# Altium schematic sheet Sheet1.SchDoc
size A1; SheetNumber: 1; SheetTotal: 1
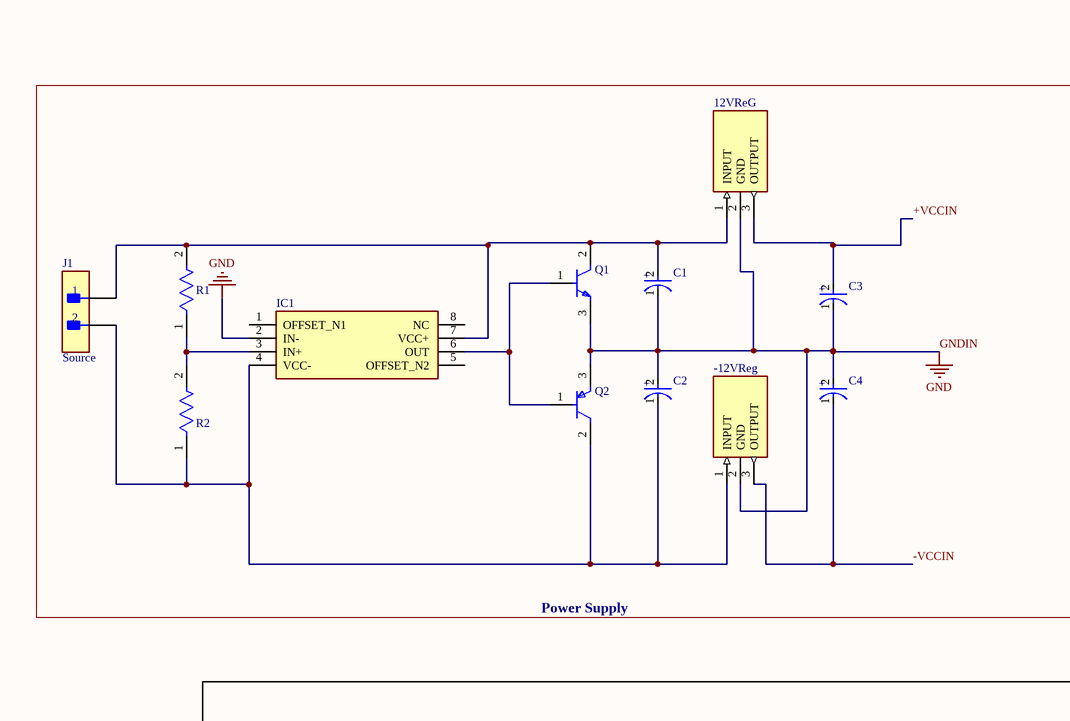
[diagram p0: Sheet1.SchDoc, top left]
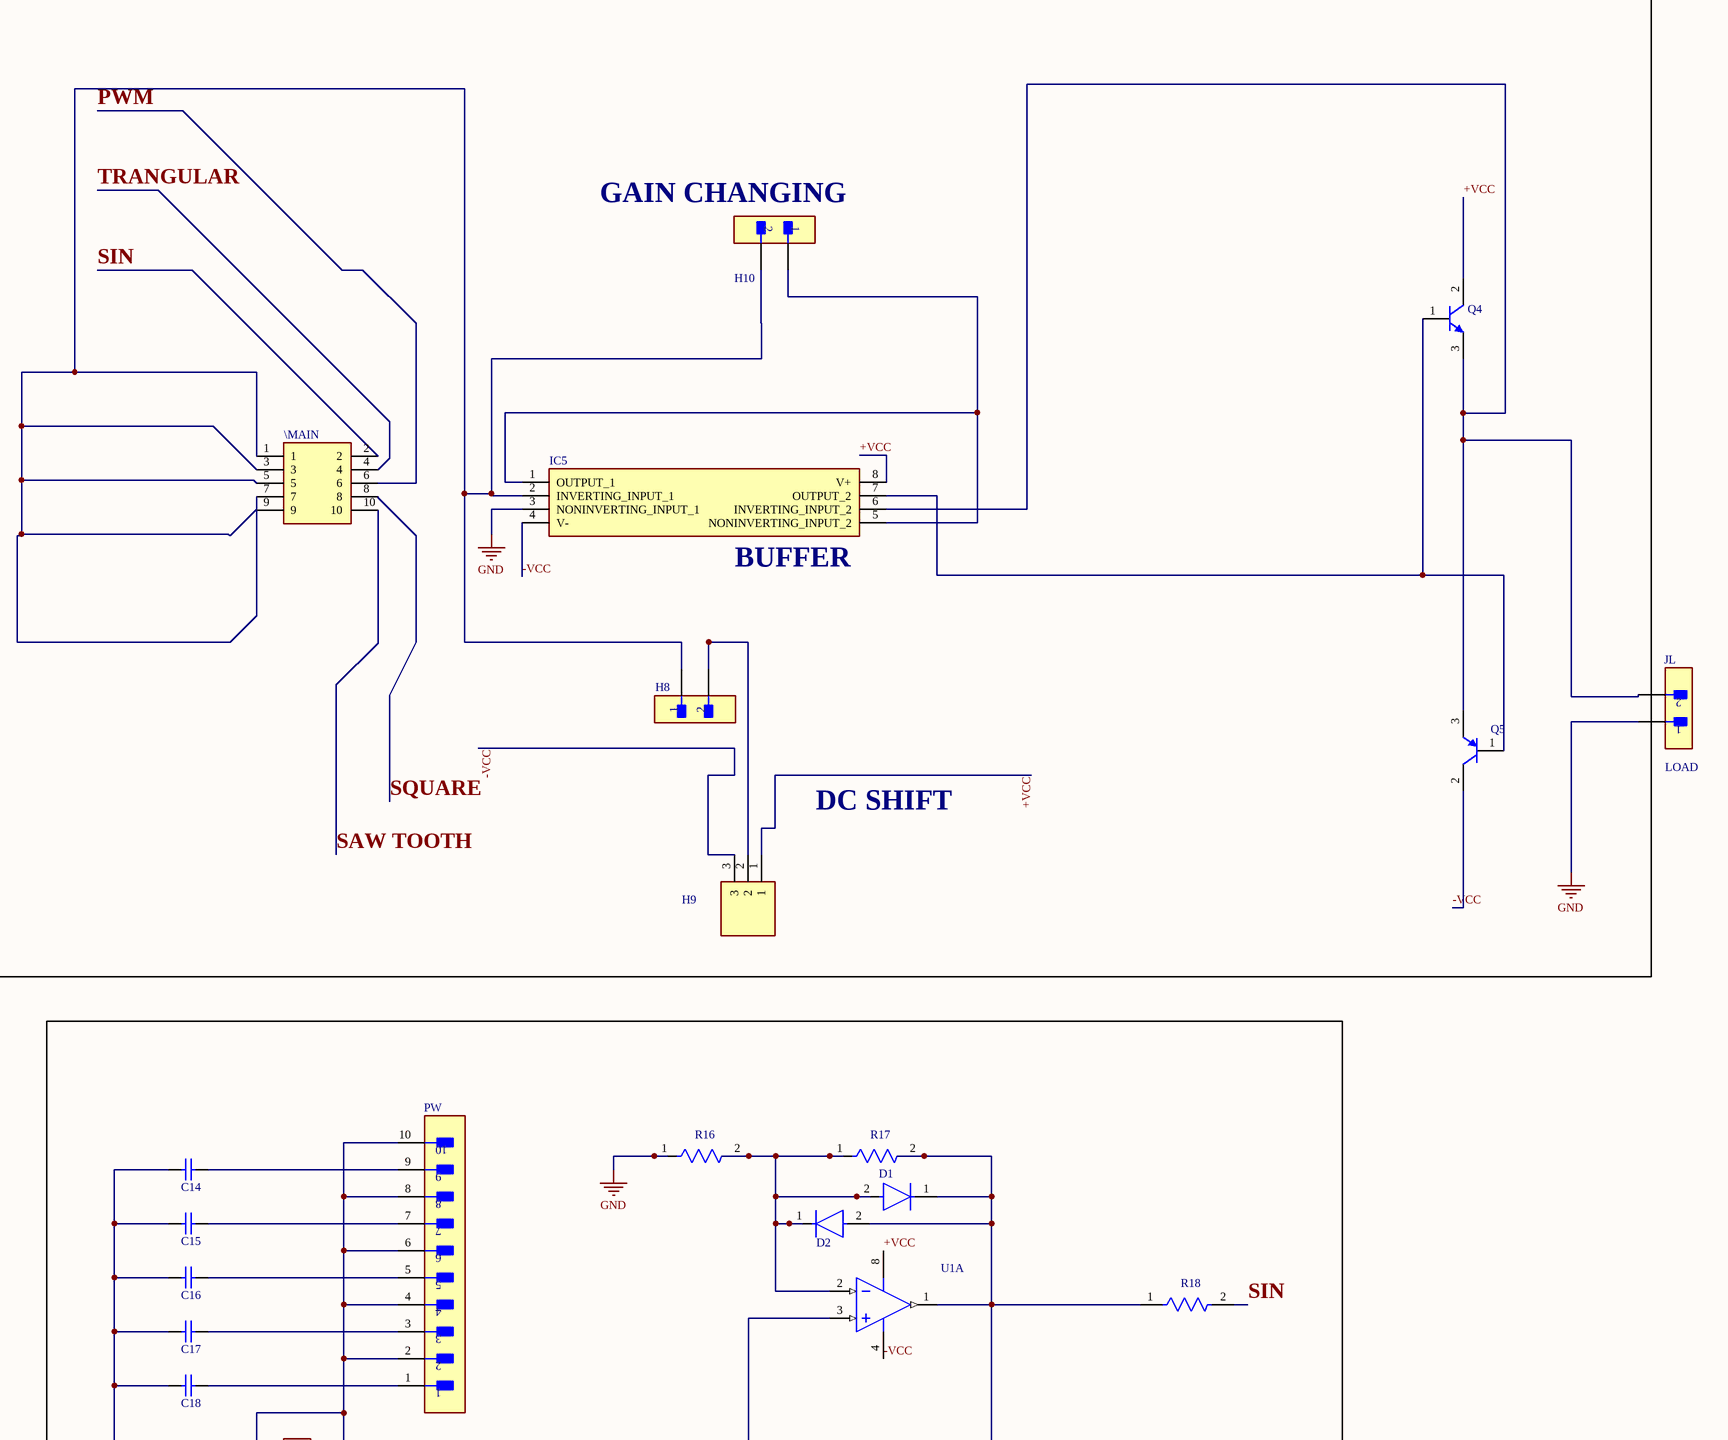
[diagram p1: Sheet1.SchDoc, top right]
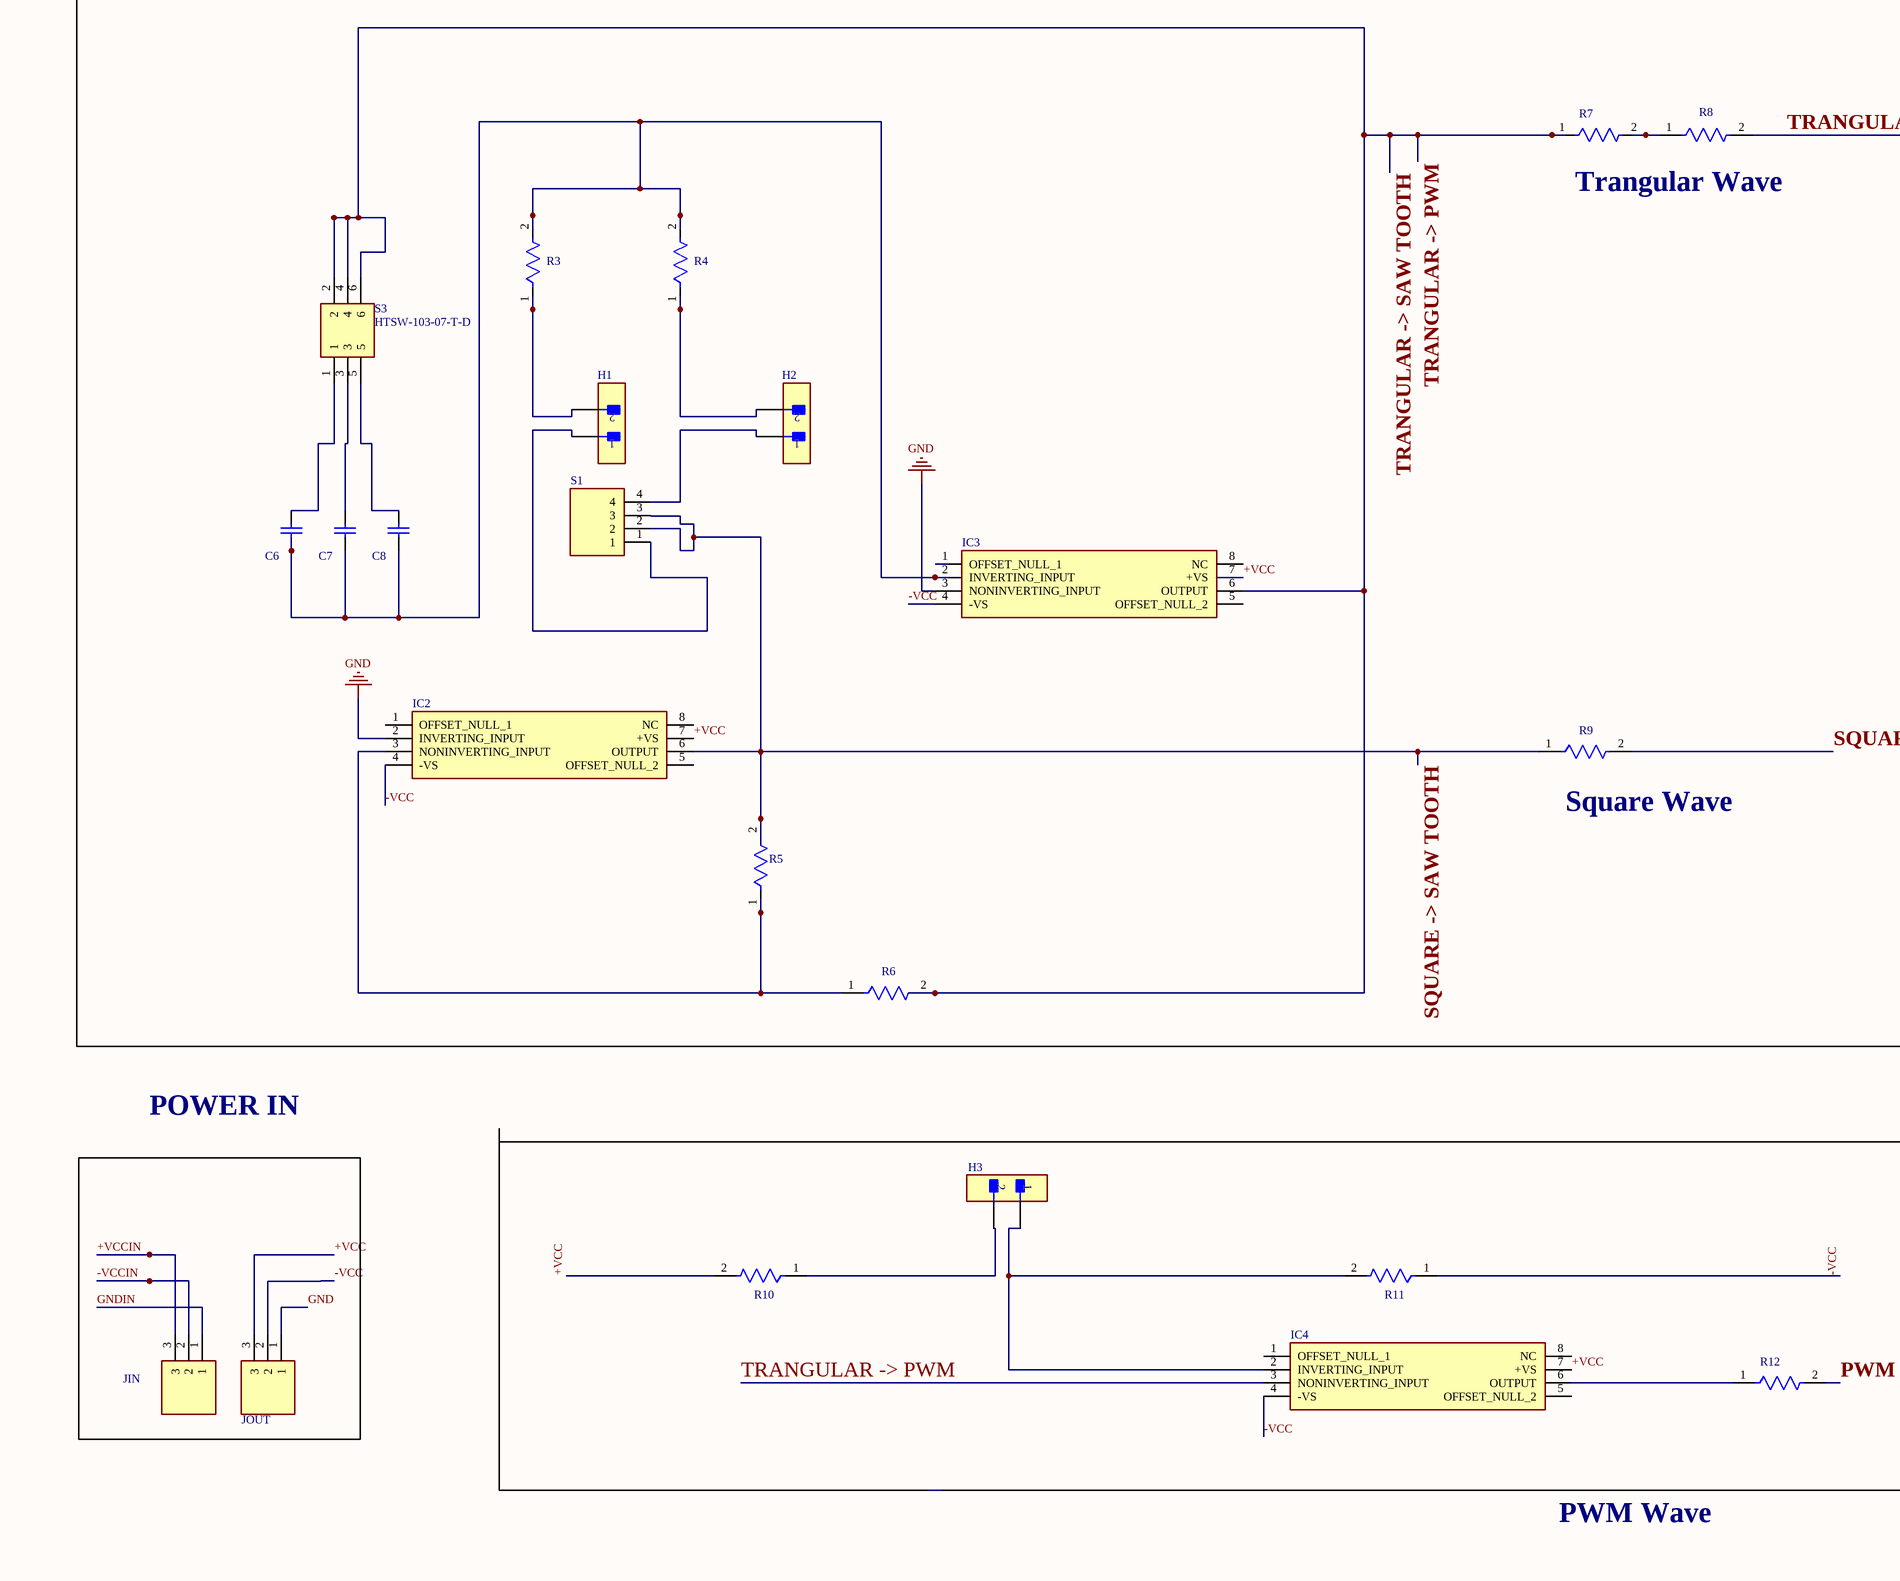
[diagram p2: Sheet1.SchDoc, bottom left]
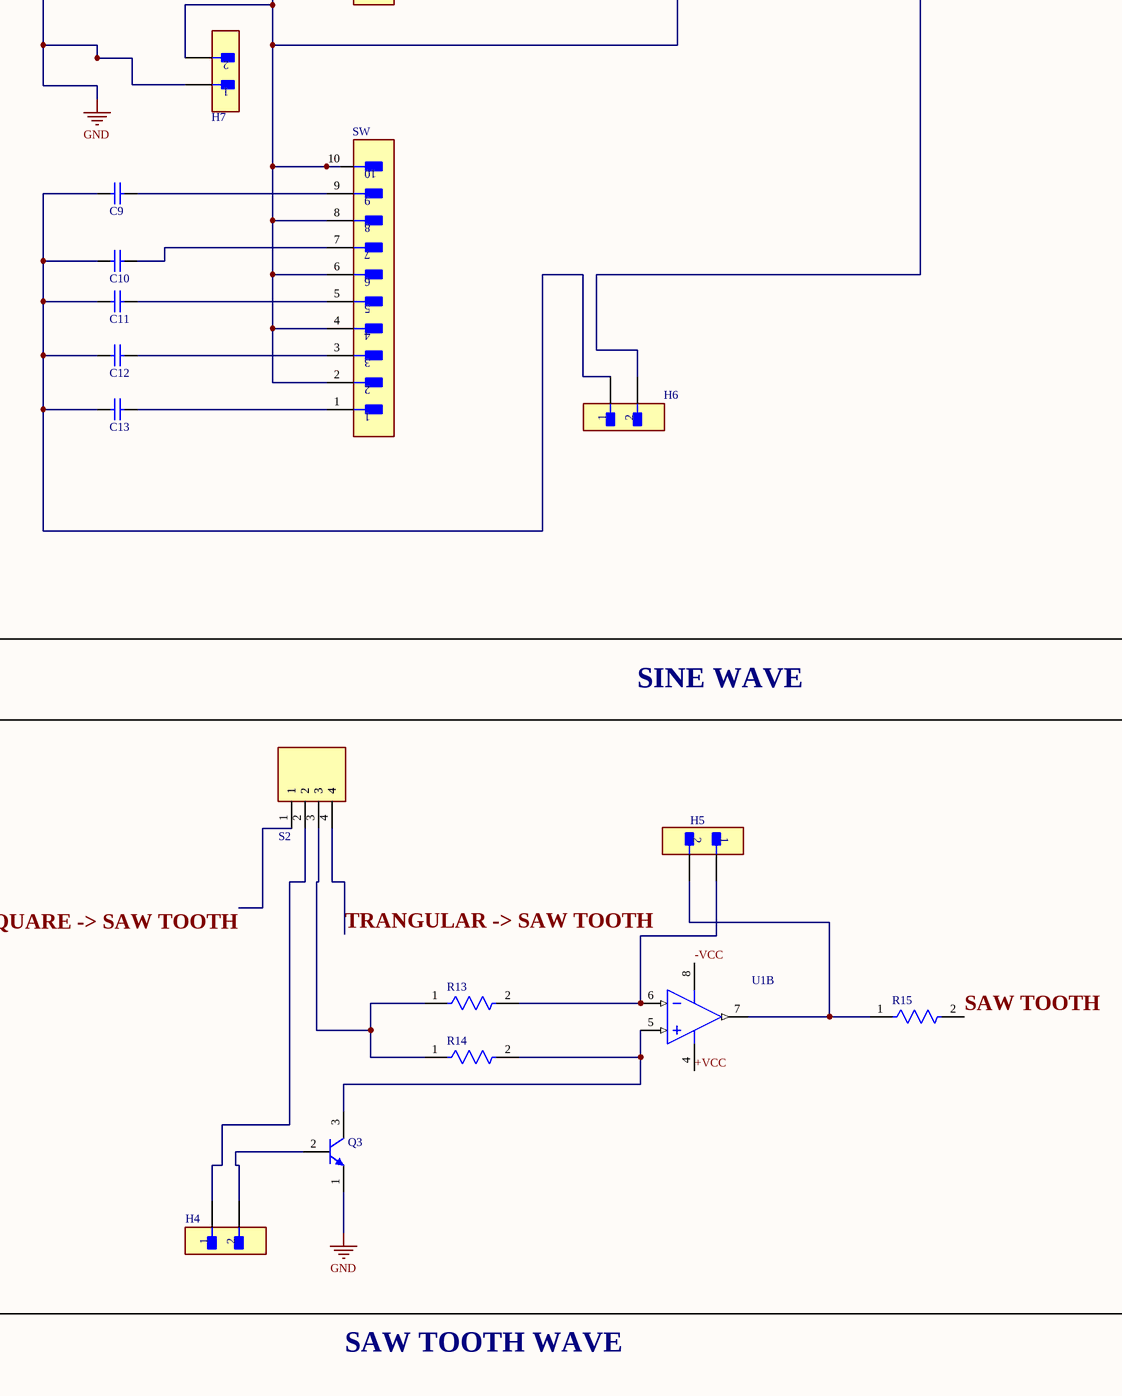
[diagram p3: Sheet1.SchDoc, bottom right]

## Parts
12VReG  LM7812CT  [TO254P470X1028X1955-3P]  (value not drawn)
-12VReg  LM7812CT  [TO254P470X1028X1955-3P]  (value not drawn)
\MAIN  61201021621  [SHDR10W64P254_2X5_2036X885X925P]  (value not drawn)
C1  EEUFR1E391L  [FP-RAD-TH-D_8_0_5-L_15_1-MFG]  (value not drawn)
C2  EEUFR1E391L  [FP-RAD-TH-D_8_0_5-L_15_1-MFG]  (value not drawn)
C3  EEUFR1E391L  [FP-RAD-TH-D_8_0_5-L_15_1-MFG]  (value not drawn)
C4  EEUFR1E391L  [FP-RAD-TH-D_8_0_5-L_15_1-MFG]  (value not drawn)
C6  1uF  [KEMT-C333C105M5U5TA-2]  (value not drawn)
C7  0.1uF  [KEMT-C333C105M5U5TA-2]  (value not drawn)
C8  0.01uF  [KEMT-C333C105M5U5TA-2]  (value not drawn)
C9  10uF  [KEMT-C333C105M5U5TA-2]  (value not drawn)
C10  1uF  [KEMT-C333C105M5U5TA-2]  (value not drawn)
C11  100nF  [KEMT-C333C105M5U5TA-2]  (value not drawn)
C12  10nF  [KEMT-C333C105M5U5TA-2]  (value not drawn)
C13  1nF  [KEMT-C333C105M5U5TA-2]  (value not drawn)
C14  10uF  [KEMT-C333C105M5U5TA-2]  (value not drawn)
C15  1uF  [KEMT-C333C105M5U5TA-2]  (value not drawn)
C16  100nF  [KEMT-C333C105M5U5TA-2]  (value not drawn)
C17  10nF  [KEMT-C333C105M5U5TA-2]  (value not drawn)
C18  1nF  [KEMT-C333C105M5U5TA-2]  (value not drawn)
D1  1N4148  [FP-017AG-MFG]  (value not drawn)
D2  1N4148  [FP-017AG-MFG]  (value not drawn)
H1  LOAD  [FP-B2B-XH-A_LF_SN-MFG]  (value not drawn)
H2  LOAD  [FP-B2B-XH-A_LF_SN-MFG]  (value not drawn)
H3  LOAD  [FP-B2B-XH-A_LF_SN-MFG]  (value not drawn)
H4  LOAD  [FP-B2B-XH-A_LF_SN-MFG]  (value not drawn)
H5  LOAD  [FP-B2B-XH-A_LF_SN-MFG]  (value not drawn)
H6  LOAD  [FP-B2B-XH-A_LF_SN-MFG]  (value not drawn)
H7  LOAD  [FP-B2B-XH-A_LF_SN-MFG]  (value not drawn)
H8  LOAD  [FP-B2B-XH-A_LF_SN-MFG]  (value not drawn)
H9  0022232031  [HDRV3W87P0X254_1X3_747X635X1105P]  (value not drawn)
H10  LOAD  [FP-B2B-XH-A_LF_SN-MFG]  (value not drawn)
IC1  TL071CP  [DIP794W53P254L959H508Q8N]  (value not drawn)
IC2  AD711JN  [DIP794W56P254L928H457Q8N]  (value not drawn)
IC3  AD711JN  [DIP794W56P254L928H457Q8N]  (value not drawn)
IC4  AD711JN  [DIP794W56P254L928H457Q8N]  (value not drawn)
IC5  AD712JNZ  [DIP794W56P254L959H533Q8N]  (value not drawn)
J1  Source  [FP-B2B-XH-A_LF_SN-MFG]
JIN  0022232031  [HDRV3W87P0X254_1X3_747X635X1105P]  (value not drawn)
JL  LOAD  [FP-B2B-XH-A_LF_SN-MFG]
JOUT  0022232031  [HDRV3W87P0X254_1X3_747X635X1105P]  (value not drawn)
PW  in 1  [FP-4-644456-0-MFG]  (value not drawn)
Q1  TIP31C  [FP-TO-220-P0A0015988-MFG]  (value not drawn)
Q2  TIP32C  [FP-TO-220-P0A0015988-MFG]  (value not drawn)
Q3  SAWTOOTH  [FAIR-TO-92]  (value not drawn)
Q4  TIP31A  [ONSC-TO-220-3-221A-09]  (value not drawn)
Q5  TIP32A  [ONSC-TO-220-3-221A-09]  (value not drawn)
R1  100K  [FP-RR01-MFG]  (value not drawn)
R2  100K  [FP-RR01-MFG]  (value not drawn)
R3  150ohm  [FP-RLR07-MFG]  (value not drawn)
R4  10K  [FP-RLR07-MFG]  (value not drawn)
R5  1K  [FP-MBB0207-MFG]  (value not drawn)
R6  150OHM  [FP-MBB0207-MFG]  (value not drawn)
R7  6.8K  [FP-MBB0207-MFG]  (value not drawn)
R8  10K  [FP-MBB0207-MFG]  (value not drawn)
R9  10K  [FP-MBB0207-MFG]  (value not drawn)
R10  10K  [FP-MBB0207-MFG]  (value not drawn)
R11  10K  [FP-MBB0207-MFG]  (value not drawn)
R12  68Kohm  [FP-MBB0207-MFG]  (value not drawn)
R13  10K  [FP-MBB0207-MFG]  (value not drawn)
R14  10K  [FP-MBB0207-MFG]  (value not drawn)
R15  10k  [FP-MBB0207-MFG]  (value not drawn)
R16  5K  [FP-MBB0207-MFG]  (value not drawn)
R17  10K  [FP-MBB0207-MFG]  (value not drawn)
R18  0.5K  [FP-MBB0207-MFG]  (value not drawn)
S1  B4B-XH-A_LF__SN_  [B4BXHALFSN]  (value not drawn)
S2  B4B-XH-A_LF__SN_  [B4BXHALFSN]  (value not drawn)
S3  HTSW-103-07-T-D  [HDRV6W64P254_2X3_762X502X838P]
SW  in2  [FP-4-644456-0-MFG]  (value not drawn)
U1  TL072CP  [P0008A]  (value not drawn)  (parts A,B of 2)

## Blocks framed on the sheet
Power Supply: 12VReG -12VReg C1-C4 IC1 J1 Q1 Q2 R1 R2

## Nets
GND: 12VReG.2(GND) -12VReg.2(GND) C1.1(C) C2.2(A) C3.1(C) C4.2(A) C14.2 C15.2 C16.2 C17.2 C18.2 H7.1 IC1.2(IN-) IC2.2(INVERTING_INPUT) IC3.3(NONINVERTING_INPUT) IC5.3(NONINVERTING_INPUT_1) JIN.1 JL.1 JOUT.1 Q1.3(E) Q2.3(E) Q3.1(E) R16.1  [also labelled GNDIN]
+VCC: H9.1 IC2.7(+VS) IC3.7(+VS) IC4.7(+VS) IC5.8(V+) JOUT.3 Q4.2(C) R10.2 U1.4(VCC-) U1.8(VCC+)
+VCCIN: 12VReG.3(OUTPUT) C3.2(A) JIN.3
-VCC: H9.3 IC2.4(-VS) IC3.4(-VS) IC4.4(-VS) IC5.4(V-) JOUT.2 Q5.2(C) R11.1 U1.4(VCC-) U1.8(VCC+)
-VCCIN: -12VReg.3(OUTPUT) C4.1(C) JIN.2
PWM: \MAIN.6 R12.2
SAW TOOTH: \MAIN.10 R15.2
SIN: \MAIN.2 R18.2
SQUARE: \MAIN.8 R9.2
SQUARE -> SAW TOOTH: IC2.6(OUTPUT) R5.2 R9.1 S1.2 S1.3 S2.1
TRANGULAR: \MAIN.4 R8.2
TRANGULAR -> PWM: IC3.6(OUTPUT) IC4.3(NONINVERTING_INPUT) R6.2 R7.1 S2.4 S3.2 S3.4 S3.6  [also labelled TRANGULAR -> SAW TOOTH]
Net12VReG_1: 12VReG.1(INPUT) C1.2(A) IC1.7(VCC+) J1.1 Q1.2(C) R1.2
Net-12VReg_1: -12VReg.1(INPUT) C2.1(C) IC1.4(VCC-) J1.2 Q2.2(C) R2.1
Ne~{t}MAIN_1: \MAIN.1 \MAIN.3 \MAIN.5 \MAIN.7 \MAIN.9 H8.1 H10.2 IC5.2(INVERTING_INPUT_1)
NetC6_1: C6.1 C7.1 C8.1 IC3.2(INVERTING_INPUT) R3.2 R4.2
NetC6_2: C6.2 S3.1
NetC7_2: C7.2 S3.3
NetC8_2: C8.2 S3.5
NetC9_1: C9.1 SW.9
NetC9_2: C9.2 C10.2 C11.2 C12.2 C13.2 H6.1
NetC10_1: C10.1 SW.7
NetC11_1: C11.1 SW.5
NetC12_1: C12.1 SW.3
NetC13_1: C13.1 SW.1
NetC14_1: C14.1 PW.9
NetC15_1: C15.1 PW.7
NetC16_1: C16.1 PW.5
NetC17_1: C17.1 PW.3
NetC18_1: C18.1 PW.1
NetD1_1: D1.1(C) D2.2(A) H6.2 R17.2 R18.1 U1.1(OUT1)
NetD1_2: D1.2(A) D2.1(C) R16.2 R17.1 U1.2(IN1-)
NetH1_1: H1.1 S1.1
NetH1_2: H1.2 R3.1
NetH2_1: H2.1 S1.4
NetH2_2: H2.2 R4.1
NetH3_1: H3.1 IC4.2(INVERTING_INPUT) R11.2
NetH3_2: H3.2 R10.1
NetH4_1: H4.1 S2.2
NetH4_2: H4.2 Q3.2(B)
NetH5_1: H5.1 R13.2 U1.6(IN2-)
NetH5_2: H5.2 R15.1 U1.7(OUT2)
NetH7_2: H7.2 PW.2 PW.4 PW.6 PW.8 PW.10 SW.2 SW.4 SW.6 SW.8 SW.10 U1.3(IN1+)
NetH8_2: H8.2 H9.2
NetH10_1: H10.1 IC5.1(OUTPUT_1) IC5.5(NONINVERTING_INPUT_2)
NetIC1_3: IC1.3(IN+) R1.1 R2.2
NetIC1_6: IC1.6(OUT) Q1.1(B) Q2.1(B)
NetIC2_3: IC2.3(NONINVERTING_INPUT) R5.1 R6.1
NetIC4_6: IC4.6(OUTPUT) R12.1
NetIC5_6: IC5.6(INVERTING_INPUT_2) JL.2 Q4.3(E) Q5.3(E)
NetIC5_7: IC5.7(OUTPUT_2) Q4.1(B) Q5.1(B)
NetQ3_3: Q3.3(C) R14.2 U1.5(IN2+)
NetR7_2: R7.2 R8.1
NetR13_1: R13.1 R14.1 S2.3

Not connected (* = marked no-connect by the designer): IC1 1(OFFSET_N1) 5(OFFSET_N2) 8(NC); IC2 1(OFFSET_NULL_1) 5(OFFSET_NULL_2) 8(NC); IC3 1(OFFSET_NULL_1) 5(OFFSET_NULL_2) 8(NC); IC4 1(OFFSET_NULL_1) 5(OFFSET_NULL_2) 8(NC)

## Notes on the sheet
- (near H10) GAIN CHANGING
- (near IC5) BUFFER
- DC SHIFT
- Trangular Wave
- (near R9) Square Wave
- SINE WAVE
- POWER IN
- PWM Wave
- SAW TOOTH WAVE
- (in symbol CMP-05427-000460-1) +

## Library data of the parts
12VReG -12VReg = LM7812CT: Integrated Circuit; Manufacturer_Name: Texas Instruments; Datasheet Link: http://www.ti.com/lit/ds/symlink/lm7800.pdf; Height: 4.7mm; Manufacturer_Part_Number: LM7812CT; Mouser Part Number: 926-LM7812CT; Mouser Price/Stock: https://www.mouser.co.uk/ProductDetail/Texas-Instruments/LM7812CT?qs=QbsRYf82W3EQj7KGft8TFg%3D%3D
\MAIN = 61201021621: Connector; Manufacturer_Name: Wurth Elektronik; Datasheet Link: https://datasheet.datasheetarchive.com/originals/distributors/Datasheets_SAMA/ec2d1eaddfe1dc3d07279947380a13e2.pdf; Height: 9.25mm; Manufacturer_Part_Number: 61201021621; Mouser Part Number: 710-61201021621; Mouser Price/Stock: https://www.mouser.co.uk/ProductDetail/Wurth-Elektronik/61201021621?qs=W%252B2sBeLta1a0dwX5pxbfXw%3D%3D
C1-C4 = CMP-05427-000460-1: Aluminum Electrolytic Capacitors (Radial Lead Type) 390uF ±20% 25V; Impedance: 41mR; Lead Diameter: 0.6mm; Ripple Current (AC): 1.24A; Life (Hours): 8000Hour; Dielectric Material: Aluminium; Length: 15mm; Case/Package: Radial; Termination: Radial; Tolerance: 20%; Series: FR; RoHS Compliant: Yes; Height: 15mm; Package Quantity: 200; Construction: RADIAL; Diameter: 8mm; Mount: Through Hole; REACH SVHC: No SVHC; Voltage Rating: 25V; Packaging: Bulk; ESR (Equivalent Series Resistance): 41mR; Min Operating Temperature: -40°C; Ripple Current: 1.24A; Max Operating Temperature: 105°C; Lead Pitch: 3.5mm; Radiation Hardening: No; Capacitance: 390uF; Voltage: 25V; Number of Pins: 2; Height - Seated (Max): 0.65inch; Voltage Rating (DC): 25V
C6 C10 C15 = CMP-2000-05174-1: Multilayer Ceramic Capacitor / Axial and Radial Leaded, 1 uF, +/- 20%, 10 to 85 degC, 2-Pin THD, RoHS, Bulk; Manufacturer: Kemet; Voltage Rating: 50V; Temperature Coefficient / Code: Z5U; Case Height: 3.81mm; Lead Diameter: 0.51mm; Case Style: ConformallyCoated; Dissipation Factor DF: 4; Case Length: 9.91mm; Type: RadialLeads; Case Width: 7.62mm; Dimensions: 7.62mmWx9.91mmLx3.81mmH; Termination Style: Radial; Factory Pack Quantity: 250; Packaging: Bulk; RoHS: Details; Datasheet Version: Jul-09; Lead Spacing: 5.08mm; Product Category: MultilayerCeramicCapacitorsMLCC-Leaded; Maximum Operating Temperature: +125C; Product: GeneralTypeMLCCs; Manufacturer URL: http://www.kemet.com/; Capacitance: 1uF; Lead Style: InsideBend; Operating Temperature Range: -55Cto+125C; Datasheet URL: http://www.farnell.com/datasheets/706880.pdf; Voltage Rating DC: 50V; Brand: Kemet; Series: C333; Tolerance: 20%; Minimum Operating Temperature: -55C
C7-C9 C11-C14 C16-C18 = CMP-2000-05174-1: Multilayer Ceramic Capacitor / Axial and Radial Leaded, 1 uF, +/- 20%, 10 to 85 degC, 2-Pin THD, RoHS, Bulk; Manufacturer: Kemet; Voltage Rating: 50V; Temperature Coefficient / Code: Z5U; Case Height: 3.81mm; Lead Diameter: 0.51mm; Case Style: ConformallyCoated; Dissipation Factor DF: 4; Capacitance: 1uF; Case Length: 9.91mm; Type: RadialLeads; Case Width: 7.62mm; Dimensions: 7.62mmWx9.91mmLx3.81mmH; Termination Style: Radial; Factory Pack Quantity: 250; Packaging: Bulk; RoHS: Details; Datasheet Version: Jul-09; Lead Spacing: 5.08mm; Product Category: MultilayerCeramicCapacitorsMLCC-Leaded; Maximum Operating Temperature: +125C; Product: GeneralTypeMLCCs; Manufacturer URL: http://www.kemet.com/; Lead Style: InsideBend; Operating Temperature Range: -55Cto+125C; Datasheet URL: http://www.farnell.com/datasheets/706880.pdf; Voltage Rating DC: 50V; Brand: Kemet; Series: C333; Tolerance: 20%; Minimum Operating Temperature: -55C
D1 D2 = CMP-07163-000046-1: DIODE GEN PURP 100V 200MA DO35; Forward Voltage: 1V; Max Power Dissipation: 500mW; Max Reverse Current: 5uA; Forward Current: 300mA; Current: 4A; Reverse Recovery Time: 4ns; Element Configuration: Single; Outside Diameter: 1.85mm; Capacitance: 4pF; Polarity: Standard; Max Forward Surge Current (Ifsm): 1A; Reverse Voltage: 100V; Output Current: 200mA; Average Rectified Current: 200mA; Diameter: 1.91mm; Max Repetitive Reverse Voltage (Vrrm): 100V; Current Rating: 200mA; Case/Package: DO-35; Lead Free: Lead Free; Number of Pins: 2; Recovery Time: 4ns; Packaging: Bulk; Contact Plating: Tin; Voltage: 100V; Mount: Through Hole; Max Surge Current: 4A; Package Quantity: 2000; Width: 1.91mm; Max Reverse Voltage (DC): 100V; Length: 4.56mm; Radiation Hardening: No; Power Dissipation: 500mW; Voltage Rating (DC): 100V; Peak Non-Repetitive Surge Current: 4A; REACH SVHC: No SVHC; Height: 4.56mm; Max Operating Temperature: 175°C; Series: -; Weight: 0.01lb; Min Operating Temperature: -65°C
H1-H8 H10 J1 JL = CMP-2000-05888-3: CONN HEADER VERT 2POS 2.5MM; Current Rating: 3A; Voltage Rating: 250V; Number of Contacts: 2; Contact Resistance: 20mR; Wire/Cable Gauge: 22AWG; Insulation Resistance: 1GR; Connector Type: Male Pin; Packaging: Bulk; Contact Material: Brass; Lead Free: Lead Free; Orientation: Straight; Contact Plating: Tin; Max Current Rating: 3A; Termination: Solder; Fastening Type: Detent; Depth: 5.75mm; Housing Material: Polyamide; REACH SVHC: No SVHC; Series: XH; Voltage Rating (AC): 250V; Number of Positions: 2; Color: Natural; Contact Type: Male Pin; Max Voltage Rating (DC): 250V; Pitch: 2.5mm; Lead Pitch: 2.5mm; Mount: Through Hole; Max Operating Temperature: 85°C; Length: 7.4mm; Max Voltage Rating (AC): 250V; Min Operating Temperature: -25°C; Number of Rows: 1; Housing Color: White
H9 JIN JOUT = 0022232031: Connector; Manufacturer_Name: Molex; Datasheet Link: https://www.molex.com/pdm_docs/sd/022232031_sd.pdf; Height: 11.05mm; Manufacturer_Part_Number: 0022232031; Mouser Part Number: N/A; Mouser Price/Stock: https://www.mouser.co.uk/ProductDetail/Molex/0022232031?qs=PBcRNPEHKsqLjUBIVcYwpw%3D%3D; Arrow Part Number: 0022232031; Arrow Price/Stock: https://www.arrow.com/en/products/0022232031/molex?region=europe
IC1 = TL071CP: Integrated Circuit; Manufacturer_Name: Texas Instruments; Datasheet Link: http://www.ti.com/lit/ds/symlink/tl071a.pdf; Height: 5.08mm; Manufacturer_Part_Number: TL071CP; Mouser Part Number: 595-TL071CP; Mouser Price/Stock: https://www.mouser.co.uk/ProductDetail/Texas-Instruments/TL071CP?qs=3FVjRv9mUZ%2FN1XJT5coqUQ%3D%3D; Arrow Part Number: TL071CP; Arrow Price/Stock: https://www.arrow.com/en/products/tl071cp/texas-instruments?region=nac
IC2-IC4 = AD711JN: Integrated Circuit; Manufacturer_Name: Analog Devices; Datasheet Link: https://www.analog.com/media/en/technical-documentation/data-sheets/AD711.pdf; Height: 4.57mm; Manufacturer_Part_Number: AD711JN
IC5 = AD712JNZ: Integrated Circuit; Manufacturer_Name: Analog Devices; Datasheet Link: https://datasheet.datasheetarchive.com/originals/distributors/Datasheets-1/DSA-2049.pdf; Height: 5.33mm; Manufacturer_Part_Number: AD712JNZ; Mouser Part Number: 584-AD712JNZ; Mouser Price/Stock: https://www.mouser.co.uk/ProductDetail/Analog-Devices/AD712JNZ?qs=NmRFExCfTkHkv4a3jawdPw%3D%3D; Arrow Part Number: AD712JNZ; Arrow Price/Stock: https://www.arrow.com/en/products/ad712jnz/analog-devices?region=nac
PW SW = CMP-03369-000038-1: CONN HEADER VERT 10POS 2.54MM; Manufacturer Part Number: 4-644456-0; Manufacturer: TE Connectivity; Current Rating: 5A; Conn Gender: Male; Number Of Contacts: 10; Conn Orientation: Vertical; Voltage Rating: 250V; Number Of Rows: 1; Device Class L3: unset; Octopart: https://octopart.com/4-644456-0-te+connectivity-39514173; Pitch: 2.54mm; Mouser Description: Headers & Wire Housings NARROW FLT HDR 10P Straight Post; ComponentLink2Description: Datasheet; Height: 0.408inch; Package: 4-644456-0; RoHS: TRUE; Temperature Range High: +105°C; Digikey Description: CONN HEADER VERT 10POS 2.54MM; Temperature: -55°C to +105°C; Device Class L2: Headers and Wire Housings; Automotive: No; Lead Free: Yes; Contact Material: Tin; Temperature Range Low: -55°C; Footprint Url: https://www.te.com/commerce/DocumentDelivery/DDEController?Action=showdoc&DocId=Customer+Drawing%7F644456%7FD2%7Fpdf%7FEnglish%7FENG_CD_644456_D2.pdf%7F4-644456-0; Device Class L1: Connectors; Category: Conn; ComponentLink2URL: https://www.te.com/commerce/DocumentDelivery/DDEController?Action=showdoc&DocId=Data+Sheet%7F82056_MTA%7F0818%7Fpdf%7FEnglish%7FENG_DS_82056_MTA_0818.pdf%7F4-644456-0
Q1 = CMP-12195-000001-1: TRANS NPN 100V 3A TO-220; Manufacturer: STMicroelectronics; Hfe Max: 50; Number Of Npn: 1; Max Junction Temp: +150°C; Standoff Height: 3.5mm; Emitter Base Voltage: 5V; Collector Emitter Saturation Voltage: 1.2V; Power Dissipation: 2W; Hfe Testvce: 4V; Hfe Min: 10; Device Class L2: Transistors; ComponentLink2URL: https://www.st.com/resource/en/datasheet/tip31c.pdf; Device Class L1: Discrete Semiconductors; Digikey Description: TRANS NPN 100V 3A TO-220; Max Collector Current: 3A; RoHS: TRUE; Height: 19.68mm; Mouser Description: Bipolar Transistors - BJT NPN Gen Pur Power; Number Of Elements: 1; Package: TO-220-P0A0015988; Temperature: to +150°C; Octopart: https://octopart.com/tip31c-stmicroelectronics-15555; Manufacturer Part Number: TIP31C; Category: Trans; Hfe Testic: 3A; Lead Free: Yes; Collector Base Voltage: 100V; Device Class L3: BJTs; Collector Emitter Voltage: 100V; Automotive: No; ComponentLink2Description: Datasheet; Temperature Range High: +150°C
Q2 = CMP-12195-000005-1: TRANS PNP 100V 3A TO-220; Manufacturer: STMicroelectronics; Standoff Height: 3.5mm; Number Of Pnp: 1; Max Collector Current: -3A; Emitter Base Voltage: -5V; Collector Emitter Voltage: -100V; Hfe Testvce: -4V; Hfe Max: 50; Collector Emitter Saturation Voltage: -1.2V; Power Dissipation: 2W; Max Junction Temp: +150°C; Hfe Min: 10; Device Class L3: BJTs; Mouser Description: Original ST Microelectronics Transistor, 100V, 3A, .22 Ohm, TO-220 Package; ComponentLink2Description: Datasheet; Device Class L1: Discrete Semiconductors; Automotive: No; Number Of Elements: 1; Category: Trans; Collector Base Voltage: -100V; Package: TO-220-P0A0015988; Height: 19.68mm; Lead Free: Yes; ComponentLink2URL: https://www.st.com/resource/en/datasheet/tip32c.pdf; Hfe Testic: -3A; RoHS: TRUE; Temperature Range High: +150°C; Temperature: to +150°C; Device Class L2: Transistors; Digikey Description: TRANS PNP 100V 3A TO-220; Octopart: https://octopart.com/tip32c-stmicroelectronics-353617; Manufacturer Part Number: TIP32C
Q3 = CMP-2000-04944-1: NPN General-Purpose Amplifier, 40 V VCEO, 0.2 A, -55 to 150 degC, 2-Pin TO-92, RoHS, Bulk; Manufacturer: FairchildSemiconductor; Maximum Collector Base Voltage: 60V; Minimum DC Current Gain: 40@0.1mA@1V; Maximum Collector Emitter Voltage: 40V; Maximum DC Collector Current: 0.2A; Rad Hard: No; Maximum Operating Frequency: 300(Min)MHz; Maximum Collector Emitter Saturation Voltage: 0.2@1mA@10mA; Maximum Power Dissipation: 625mW; Package Description: 3-Pin Transistor Outline Package, Body Dia 4.79 mm, Pitch 1.27 mm; Package Reference: TO-92; Pin Count: 3; Operating Temperature: -55to150degC; Category: GPBJT; Manufacturer URL: https://www.fairchildsemi.com/; Datasheet URL: https://datasheet.ciiva.com/4722/2n3904-82270-4722369.pdf; Package: 3TO-92; Packaging: Bulk; Type: NPN; Datasheet Version: Rev. 1.1.0, 10/2014; Mounting: ThroughHole
Q4 = CMP-1048-01124-1: Complementary Silicon Plastic Power Transistor, 3-Pin TO-220, Tube; Manufacturer: On Semiconductor; IC Continuous (A): 3; Polarity: NPN; ComponentLink2Description: Datasheet; Mounting Technology: Through Hole; DatasheetVersion: Rev. 14; ComponentLink1URL: http://www.onsemi.com/; PackageReference: TO-220-3-221A-09; ComponentLink3URL: http://www.onsemi.com/pub_link/Collateral/221A-09.PDF; Packing: Tube; PartNumber: TIP31A; ComponentLink3Description: Package Specification; ComponentLink1Description: Manufacturer URL; PackageVersion: Rev. AG, 09/2011; ComponentLink2URL: http://www.onsemi.com/pub_link/Collateral/TIP31A-D.PDF; PackageDescription: 3-Pin Flange Mount, Vertical Straight Lead, Body 9.97 x 4.445 mm, Pitch 2.54 mm; fT Min (MHz): 3; RoHS: FALSE
Q5 = CMP-1048-01079-1: Complementary Silicon Plastic Power Transistor, 3-Pin TO-220, Tube; Manufacturer: On Semiconductor; Polarity: PNP; IC Continuous (A): 3; ComponentLink3Description: Package Specification; ComponentLink2URL: http://www.onsemi.com/pub_link/Collateral/TIP31A-D.PDF; PackageDescription: 3-Pin Flange Mount, Vertical Straight Lead, Body 9.97 x 4.445 mm, Pitch 2.54 mm; PackageVersion: Rev. AG, 09/2011; Mounting Technology: Through Hole; RoHS: FALSE; ComponentLink1URL: http://www.onsemi.com/; ComponentLink2Description: Datasheet; PackageReference: TO-220-3-221A-09; fT Min (MHz): 3; ComponentLink1Description: Manufacturer URL; PartNumber: TIP32A; DatasheetVersion: Rev. 14; Packing: Tube; ComponentLink3URL: http://www.onsemi.com/pub_link/Collateral/221A-09.PDF
R1 R2 = CMP-03212-000008-1: RES 100K OHM 5% 1W AXIAL; Number of Resistors: 1; Temperature Coefficient: 300ppm/°C; Voltage Rating: 350V; Resistance: 100kR; Package Quantity: 5000; Power Rating: 1W; Packaging: Ammo Pack; Min Operating Temperature: -55°C; Number of Terminations: 2; Resistor Type: Power resistor; Length: 6.8mm; ELV: Compliant; Mount: Axial; RoHS Compliant: Yes; Case/Package: Metal; Diameter: 2.6mm; Termination: Axial; Series: RR; Max Operating Temperature: 155°C; Tolerance: 5%
R3 R4 = CMP-00030-41139779-1: RLR07C7501GSB14 Res Metal Film 7.5K Ohm 2% 1/4W ±100ppm/°C 0.001% Conformal AXL Thru-Hole Bulk; Resistance: 7.5kΩ; Voltage Rating: 250V; Power Rating: 250mW; Military Standard: MIL-PRF-39017; Tolerance: 2%; Width: 2.29mm; Case/Package: Axial; Failure Rate: 0.001%; Composition: Metal Film; Height: 2.5mm; Max Operating Temperature: 150°C; Termination: Axial; Schedule B: 8533210090, 8533210090; Number of Terminations: 2; Voltage Rating (DC): 250V; RoHS: Non-Compliant; Mount: Through Hole; Packaging: Bulk; Features: Military, Moisture Resistant, Weldable; Min Operating Temperature: -65°C; Length: 7.62mm; Diameter: 2.29mm; Lead Free: Contains Lead; Max Power Dissipation: 250mW; Temperature Coefficient: 100ppm/°C; Contact Plating: Lead, Tin; NexarPartId: 41139779
R5-R18 = CMP-02408-000035-1: RES 10K OHM 0.6W 1% AXIAL; Voltage Rating: 300V; Resistance: 10kR; Max Power Dissipation: 600mW; Temperature Coefficient: 50ppm/°C; Radiation Hardening: No; Case/Package: Conformal; Termination: Axial; Military Standard: Not; Length: 6.5mm; Voltage Rating (DC): 300V; RoHS Compliant: Yes; Number of Terminations: 2; Packaging: Tape and Reel; Features: Automotive AEC-Q200; Tolerance: 1%; Min Operating Temperature: -55°C; Power Rating: 600mW; Lead Free: Lead Free; Resistor Type: Metal Film; Construction: Cylindrical; Series: MBB 0207 - Professional; Max Operating Temperature: 155°C; Diameter: 2.5mm; Resistance Tolerance: 1%; Contact Plating: Tin; Technology: THIN FILM
S1 S2 = B4B-XH-A_LF__SN_: Connector; Manufacturer_Name: JST (JAPAN SOLDERLESS TERMINALS); Manufacturer_Part_Number: B4B-XH-A(LF)(SN); Datasheet Link: https://datasheet.lcsc.com/szlcsc/JST-Sales-America-B4B-XH-A-LF-SN_C144395.pdf; Height: 7mm; Arrow Part Number: B4B-XH-A(LF)(SN); Arrow Price/Stock: https://www.arrow.com/en/products/b4b-xh-a-lf-sn/jst-manufacturing?region=europe
S3 = HTSW-103-07-T-D: Connector; Manufacturer_Name: SAMTEC; Datasheet Link: https://componentsearchengine.com/Datasheets/2/HTSW-103-07-T-D.pdf; Height: 8.38mm; Manufacturer_Part_Number: HTSW-103-07-T-D; Mouser Part Number: 200-HTSW10307TD; Mouser Price/Stock: https://www.mouser.co.uk/ProductDetail/Samtec/HTSW-103-07-T-D?qs=0lQeLiL1qyZ%2FnaT5YK%2Fi1w%3D%3D; Arrow Part Number: HTSW-103-07-T-D; Arrow Price/Stock: https://www.arrow.com/en/products/htsw-103-07-t-d/samtec?region=nac
U1 = CMP-0017-00950-2: Dual Low-Noise JFET-Input General-Purpose Operational Amplifier, 7 to 36 V, 0 to 70 degC, 8-pin DIP (P8), Pb-Free (RoHS); Manufacturer: Texas Instruments; Sub Family: General Purpose Amplifier, High Supply Voltage Amplifier (>=30V); Total Supply Voltage(Max)(+5V is 5, +/-5V is 10): 36; Slew Rate(Typ)(V/us): 13; Vn at 1kHz(Typ)(nV/rtHz): 18; GBW(Typ)(MHz): 3; CMRR(Min)(dB): 70; Total Supply Voltage(Min)(+5V is 5, +/-5V is 10): 7; Vio (25C)(Max)(mV): 10; Rating: Catalog; IIB(Max)(pA): 200; Iq per channel(Max)(mA): 2.5; Number of Channels: 2; Mounting Technology: Through Hole; ComponentLink3Description: Package Specification; PartNumber: TL072CP; PackageVersion: 4040082/E, 04/2010; Eco-Plan: Pb-Free (RoHS); DatasheetVersion: SLOS080J; Offset Drift(Typ)(uV/C): 18; ComponentLink3URL: http://www.ti.com/litv/pdf/mpdi001b; PackageDescription: 8-Pin Plastic In-Line, Body 9.59 x 6.35 mm, Pitch 2.54 mm; Code_JEDEC: MS-001; ComponentLink2URL: http://www.ti.com/lit/ds/symlink/tl072.pdf; ComponentLink1Description: Manufacturer URL; ComponentLink2Description: Datasheet; ComponentLink1URL: http://www.ti.com/; PackageReference: P0008A